# Altium schematic sheet Thermokoppel.SchDoc
size A4; SheetNumber: 1; SheetTotal: 4
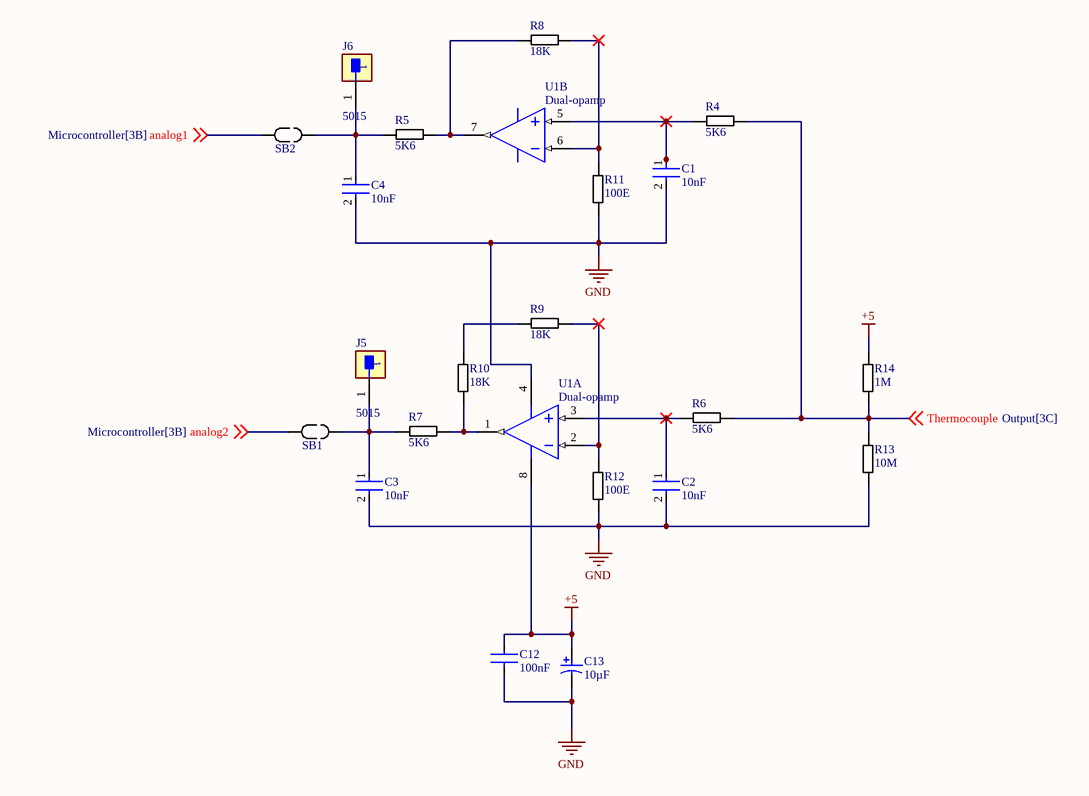
[diagram p0: Thermokoppel.SchDoc]

## Parts
C1  10nF  [RESC2013X50X30ML20T20]
C2  10nF  [RESC2013X50X30ML20T20]
C3  10nF  [RESC2013X50X30ML20T20]
C4  10nF  [RESC2013X50X30ML20T20]
C12  100nF  [RESC2013X50X30ML20T20]
C13  10µF  [CAP-SMD_BD4.0-L4.3-W4.3-FD-LS5.3]
J5  5015  [5015]
J6  5015  [5015]
R4  5K6  [RESC2013X50X30ML20T20]
R5  5K6  [RESC2013X50X30ML20T20]
R6  5K6  [RESC2013X50X30ML20T20]
R7  5K6  [RESC2013X50X30ML20T20]
R8  18K  [RESC2013X50X30ML20T20]
R9  18K  [RESC2013X50X30ML20T20]
R10  18K  [RESC2013X50X30ML20T20]
R11  100E  [RESC2013X50X30ML20T20]
R12  100E  [RESC2013X50X30ML20T20]
R13  10M  [RESC2013X50X30ML20T20]
R14  1M  [RESC2013X50X30ML20T20]
SB1  SolderBridge  [SolderBridge]  (value not drawn)
SB2  SolderBridge  [SolderBridge]  (value not drawn)
U1  Dual-opamp  [MSOP_8_S]  (parts A,B of 2)

## Nets
+5: C12.1 C13.1(+) R14.2 U1.8(VDD)
GND: C1.2 C2.2 C3.2 C4.2 C12.2 C13.2(-) R11.1 R12.1 R13.1 U1.4(VSS)
analog1: SB2.1 ; off-sheet analog1
analog2: SB1.1 ; off-sheet analog2
Thermocouple: R4.2 R6.2 R13.2 R14.1 ; off-sheet Thermocouple
NetC1_1: C1.1 R4.1 U1.5(VINB+)
NetC2_1: C2.1 R6.1 U1.3(VINA+)
NetC3_1: C3.1 J5.1 R7.1 SB1.2
NetC4_1: C4.1 J6.1 R5.1 SB2.2
NetR5_2: R5.2 R8.1 U1.7(VOUTB)
NetR7_2: R7.2 R10.1 U1.1(VOUTA)
NetR8_2: R8.2 R11.2 U1.6(VINB-)
NetR9_1: R9.1 R10.2
NetR9_2: R9.2 R12.2 U1.2(VINA-)

## Library data of the parts
C1-C4 C12 = Capacitor: Voltage Rating (DC): 6.3V; Dielectric: X5R; Capacitance: 10uF; Material: Ceramic; Tolerance: 20%; Packaging: Tape and Reel; Width: 0.031inch; Termination: SMD/SMT; Package Quantity: 4000; Voltage Rating: 6.3V; Case/Package: 0603; Min Operating Temperature: -55°C; Voltage: 6.3V; Length: 1.6mm; Thickness: 0.035inch; Lead Free: Lead Free; Depth: 0.8mm; Case Code (Imperial): 0603; Max Operating Temperature: 85°C; Height: 0.8mm; Mount: Surface Mount; REACH SVHC: No SVHC; Radiation Hardening: No; Case Code (Metric): 1608
C13 = Electrolytic capacitor: Manufacturer: Panasonic; Voltage Rating: 25 V; ComponentLink2URL: http://industrial.panasonic.com/cdbs/www-data/pdf/RDE0000/ABA0000C1181.pdf; Height: 10.2 mm; Max Operating Temperature: 105 degC; PackageReference: EEE-FK1E221P; ComponentLink1Description: Manufacturer URL; ComponentLink1URL: http://www.panasonic.com/; Mount: Surface Mount; REACH SVHC: No SVHC; Min Operating Temperature: -55 degC; ComponentLink2Description: Datasheet; DatasheetVersion: 03/2016; Length: 10.2 mm; RoHSCompliant: true; Packaging: Tape and Reel; Package Quantity: 500; Lead Pitch: 3.1 mm; Pins: 2; PackageDescription: 2-Pin Electrolytic Aluminum Capacitor, Body 8.3 x 8.3 mm; Mounting Technology: Surface Mount
J5 J6 = Testpoint: PC TEST POINT MINIATURE; Manufacturer: keystone; Number Of Contacts: 1; Conn Orientation: Straight; Category: Conn; Manufacturer Part Number: 5015; Digikey Description: PC TEST POINT MINIATURE; Automotive: No; Lead Free: Yes; Octopart: https://octopart.com/5015-keystone-3822; ComponentLink2URL: http://www.keyelco.com/product-pdf.cfm?p=1353; Package: 5015; RoHS: TRUE; Device Class L3: unset; Device Class L2: unset; Contact Material: Silver; Device Class L1: Connectors; Height: 1.65mm; ComponentLink2Description: Datasheet
R4-R14 = Resistor: Manufacturer: Vishay Dale; Part Number: CRCW08050000Z0EA
U1 = Dual-opamp: Slew Rate: 0.6V/µs; Supply Current: 100uA; Power Supply Rejection Ratio (PSRR): 86dB; Input Offset Voltage (Vos): 4.5mV; Input Bias Current: 1pA; Amplifier Type: GENERAL PURPOSE; Unity Gain Bandwidth Product: 1MHz; Number of Circuits: 2; Output Current: 23mA; Operating Supply Voltage: 5.5V; Min Supply Voltage: 1.8V; Common Mode Rejection Ratio: 60dB; Voltage Gain: 112dB; Max Supply Voltage: 6V; Package Quantity: 60; REACH SVHC: No SVHC; Min Operating Temperature: -40°C; Max Operating Temperature: 125°C; Mount: Through Hole; Nominal Supply Current: 100uA; Height: 3.3mm; Length: 9.27mm; Slew Rate-Nom: 0.6V/µs; Packaging: Rail/Tube; Output Current per Channel: 23mA; Number of Amplifiers: 2; RoHS Compliant: Yes; Radiation Hardening: No; Bandwidth: 1MHz; Lead Free: Lead Free; Width: 6.35mm; Number of Channels: 2; Gain Bandwidth Product: 1MHz; Technology: CMOS; Operating Supply Current: 100uA; Number of Elements: 2; Number of Pins: 8; Input Offset Voltage-Max: 4.5mV; Case/Package: PDIP